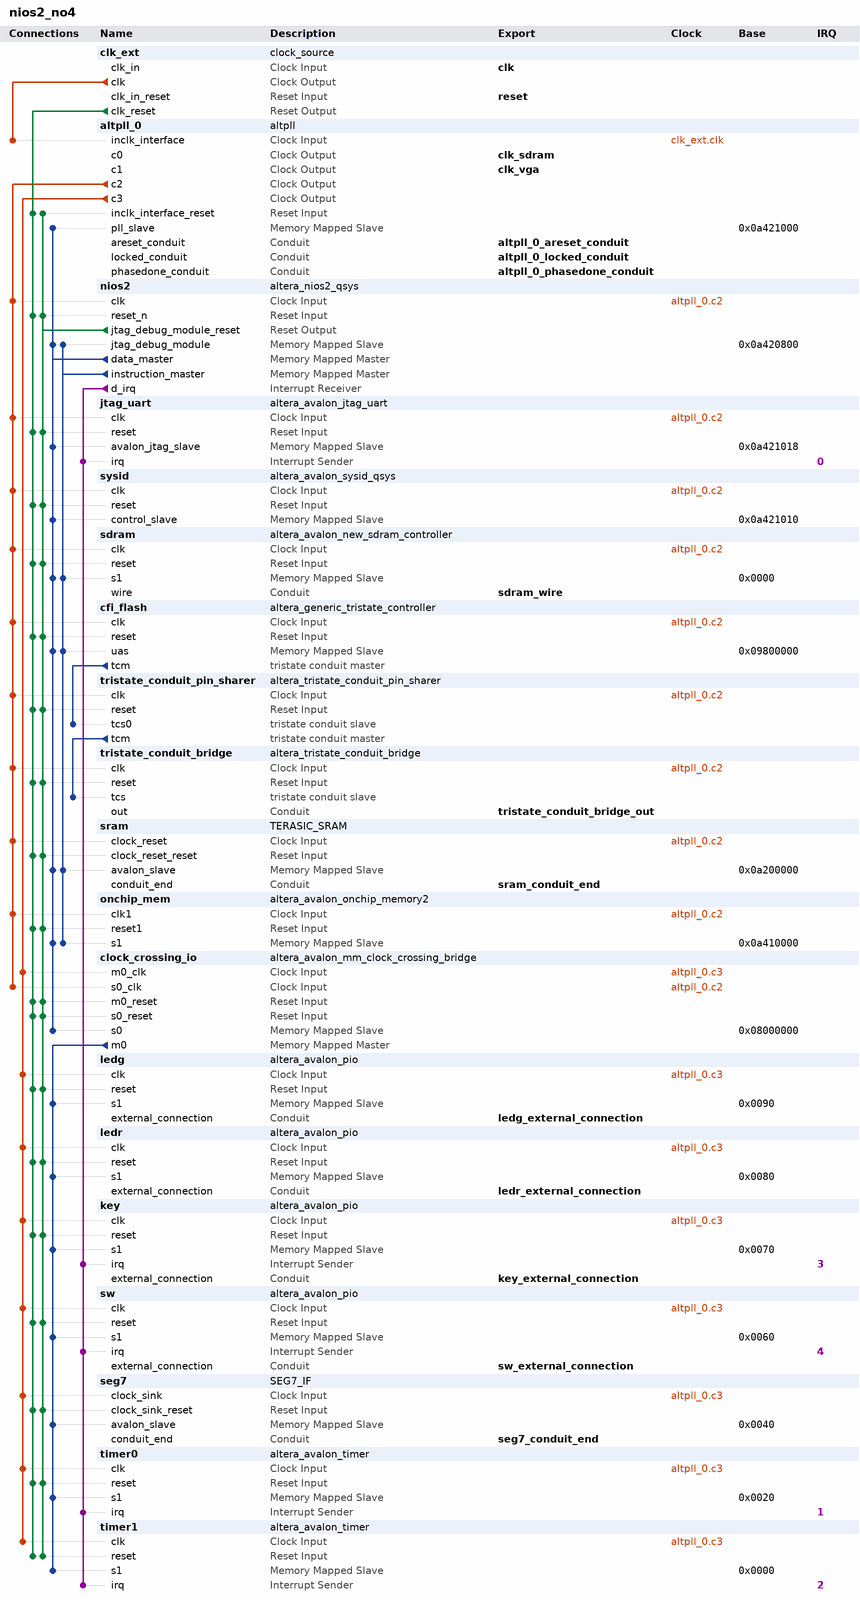
[diagram p0: system contents]
# Platform Designer (Qsys) system nios2_no4, Cyclone IV E EP4CE115F29C7
# Parameters at their usual value, and those the tool derives, are not listed.
package require -exact qsys 13.1
create_system nios2_no4
set_project_property DEVICE_FAMILY {Cyclone IV E}
set_project_property DEVICE EP4CE115F29C7

add_instance clk_ext clock_source 13.1
set_instance_parameter_value clk_ext clockFrequency 50000000

add_instance altpll_0 altpll 13.1
set_instance_parameter_value altpll_0 INCLK0_INPUT_FREQUENCY 20000
set_instance_parameter_value altpll_0 CLK0_MULTIPLY_BY 2
set_instance_parameter_value altpll_0 CLK1_MULTIPLY_BY 1
set_instance_parameter_value altpll_0 CLK2_MULTIPLY_BY 2
set_instance_parameter_value altpll_0 CLK3_MULTIPLY_BY 1
set_instance_parameter_value altpll_0 CLK0_DIVIDE_BY 1
set_instance_parameter_value altpll_0 CLK1_DIVIDE_BY 2
set_instance_parameter_value altpll_0 CLK2_DIVIDE_BY 1
set_instance_parameter_value altpll_0 CLK3_DIVIDE_BY 1
set_instance_parameter_value altpll_0 CLK0_PHASE_SHIFT -1806
set_instance_parameter_value altpll_0 CLK1_PHASE_SHIFT 0
set_instance_parameter_value altpll_0 CLK2_PHASE_SHIFT 0
set_instance_parameter_value altpll_0 CLK3_PHASE_SHIFT 0
set_instance_parameter_value altpll_0 CLK1_DUTY_CYCLE 50
set_instance_parameter_value altpll_0 CLK2_DUTY_CYCLE 50
set_instance_parameter_value altpll_0 CLK3_DUTY_CYCLE 50
set_instance_parameter_value altpll_0 PORT_clk1 PORT_USED
set_instance_parameter_value altpll_0 PORT_clk2 PORT_USED
set_instance_parameter_value altpll_0 PORT_clk3 PORT_USED
set_instance_parameter_value altpll_0 PORT_ARESET PORT_USED
set_instance_parameter_value altpll_0 PORT_LOCKED PORT_USED

add_instance nios2 altera_nios2_qsys 13.1
set_instance_parameter_value nios2 resetSlave cfi_flash.uas
set_instance_parameter_value nios2 mmu_TLBMissExcSlave None
set_instance_parameter_value nios2 exceptionSlave sdram.s1
set_instance_parameter_value nios2 breakSlave nios2.jtag_debug_module
set_instance_parameter_value nios2 impl Fast
set_instance_parameter_value nios2 icache_size 4096

add_instance jtag_uart altera_avalon_jtag_uart 13.1
set_instance_parameter_value jtag_uart simInteractiveOptions NO_INTERACTIVE_WINDOWS

add_instance sysid altera_avalon_sysid_qsys 13.1
set_instance_parameter_value sysid id 0

add_instance sdram altera_avalon_new_sdram_controller 13.1
set_instance_parameter_value sdram TAC 5.5
set_instance_parameter_value sdram TRCD 20.0
set_instance_parameter_value sdram TRP 20.0
set_instance_parameter_value sdram casLatency 3
set_instance_parameter_value sdram columnWidth 10
set_instance_parameter_value sdram dataWidth 32
set_instance_parameter_value sdram generateSimulationModel false
set_instance_parameter_value sdram model single_Micron_MT48LC4M32B2_7_chip
set_instance_parameter_value sdram numberOfBanks 4
set_instance_parameter_value sdram numberOfChipSelects 1
set_instance_parameter_value sdram powerUpDelay 100.0
set_instance_parameter_value sdram refreshPeriod 15.625
set_instance_parameter_value sdram rowWidth 13

add_instance cfi_flash altera_generic_tristate_controller 13.1
set_instance_parameter_value cfi_flash TCM_ADDRESS_W 23
set_instance_parameter_value cfi_flash TCM_DATA_W 8
set_instance_parameter_value cfi_flash TCM_BYTEENABLE_W 1
set_instance_parameter_value cfi_flash TCM_READ_WAIT 160
set_instance_parameter_value cfi_flash TCM_WRITE_WAIT 160
set_instance_parameter_value cfi_flash TCM_SETUP_WAIT 60
set_instance_parameter_value cfi_flash TCM_DATA_HOLD 60
set_instance_parameter_value cfi_flash TCM_MAX_PENDING_READ_TRANSACTIONS 3
set_instance_parameter_value cfi_flash TCM_TURNAROUND_TIME 2
set_instance_parameter_value cfi_flash TCM_TIMING_UNITS 0
set_instance_parameter_value cfi_flash TCM_READLATENCY 2
set_instance_parameter_value cfi_flash TCM_SYMBOLS_PER_WORD 1
set_instance_parameter_value cfi_flash USE_READ 1
set_instance_parameter_value cfi_flash USE_BEGINTRANSFER 0
set_instance_parameter_value cfi_flash USE_BYTEENABLE 0
set_instance_parameter_value cfi_flash USE_OUTPUTENABLE 0
set_instance_parameter_value cfi_flash ACTIVE_LOW_READ 1
set_instance_parameter_value cfi_flash ACTIVE_LOW_BYTEENABLE 0
set_instance_parameter_value cfi_flash ACTIVE_LOW_OUTPUTENABLE 0
set_instance_parameter_value cfi_flash ACTIVE_LOW_BEGINTRANSFER 0
set_instance_parameter_value cfi_flash CHIPSELECT_THROUGH_READLATENCY 0
set_instance_parameter_value cfi_flash MODULE_ASSIGNMENT_KEYS embeddedsw.configuration.hwClassnameDriverSupportList,embeddedsw.configuration.hwClassnameDriverSupportDefault,embeddedsw.CMacro.SETUP_VALUE,embeddedsw.CMacro.WAIT_VALUE,embeddedsw.CMacro.HOLD_VALUE,embeddedsw.CMacro.TIMING_UNITS,embeddedsw.CMacro.SIZE,embeddedsw.memoryInfo.MEM_INIT_DATA_WIDTH,embeddedsw.memoryInfo.HAS_BYTE_LANE,embeddedsw.memoryInfo.IS_FLASH,embeddedsw.memoryInfo.GENERATE_DAT_SYM,embeddedsw.memoryInfo.GENERATE_FLASH,embeddedsw.memoryInfo.DAT_SYM_INSTALL_DIR,embeddedsw.memoryInfo.FLASH_INSTALL_DIR
set_instance_parameter_value cfi_flash MODULE_ASSIGNMENT_VALUES altera_avalon_lan91c111:altera_avalon_cfi_flash,altera_avalon_cfi_flash,60,160,60,ns,8388608u,8,0,1,1,1,SIM_DIR,APP_DIR
set_instance_parameter_value cfi_flash INTERFACE_ASSIGNMENT_KEYS embeddedsw.configuration.isFlash,embeddedsw.configuration.isMemoryDevice,embeddedsw.configuration.isNonVolatileStorage
set_instance_parameter_value cfi_flash INTERFACE_ASSIGNMENT_VALUES 1,1,1

add_instance tristate_conduit_pin_sharer altera_tristate_conduit_pin_sharer 13.1
set_instance_parameter_value tristate_conduit_pin_sharer NUM_INTERFACES 1
set_instance_parameter_value tristate_conduit_pin_sharer MODULE_ORIGIN_LIST cfi_flash.tcm,cfi_flash.tcm,cfi_flash.tcm,cfi_flash.tcm,cfi_flash.tcm
set_instance_parameter_value tristate_conduit_pin_sharer SHARED_SIGNAL_LIST FL_ADDR,FL_OE_N,FL_WE_N,FL_DQ,FL_CE_N

add_instance tristate_conduit_bridge altera_tristate_conduit_bridge 13.1

add_instance sram TERASIC_SRAM 1.0
set_instance_parameter_value sram DATA_BITS 16
set_instance_parameter_value sram ADDR_BITS 20

add_instance onchip_mem altera_avalon_onchip_memory2 13.1
set_instance_parameter_value onchip_mem dataWidth 32
set_instance_parameter_value onchip_mem dualPort false
set_instance_parameter_value onchip_mem initMemContent true
set_instance_parameter_value onchip_mem initializationFileName onchip_mem.hex
set_instance_parameter_value onchip_mem memorySize 65536

add_instance clock_crossing_io altera_avalon_mm_clock_crossing_bridge 13.1
set_instance_parameter_value clock_crossing_io DATA_WIDTH 32
set_instance_parameter_value clock_crossing_io ADDRESS_WIDTH 10
set_instance_parameter_value clock_crossing_io MAX_BURST_SIZE 1
set_instance_parameter_value clock_crossing_io COMMAND_FIFO_DEPTH 32
set_instance_parameter_value clock_crossing_io RESPONSE_FIFO_DEPTH 256
set_instance_parameter_value clock_crossing_io MASTER_SYNC_DEPTH 3
set_instance_parameter_value clock_crossing_io SLAVE_SYNC_DEPTH 3

add_instance ledg altera_avalon_pio 13.1
set_instance_parameter_value ledg direction Output
set_instance_parameter_value ledg width 9

add_instance ledr altera_avalon_pio 13.1
set_instance_parameter_value ledr direction Output
set_instance_parameter_value ledr width 18

add_instance key altera_avalon_pio 13.1
set_instance_parameter_value key captureEdge true
set_instance_parameter_value key direction Input
set_instance_parameter_value key edgeType FALLING
set_instance_parameter_value key generateIRQ true
set_instance_parameter_value key irqType EDGE
set_instance_parameter_value key simDoTestBenchWiring true
set_instance_parameter_value key width 4

add_instance sw altera_avalon_pio 13.1
set_instance_parameter_value sw captureEdge true
set_instance_parameter_value sw direction Input
set_instance_parameter_value sw edgeType ANY
set_instance_parameter_value sw generateIRQ true
set_instance_parameter_value sw irqType EDGE
set_instance_parameter_value sw simDoTestBenchWiring true
set_instance_parameter_value sw width 18

add_instance seg7 SEG7_IF 1.0
set_instance_parameter_value seg7 SEG7_NUM 8

add_instance timer0 altera_avalon_timer 13.1
set_instance_parameter_value timer0 period 1
set_instance_parameter_value timer0 periodUnits MSEC

add_instance timer1 altera_avalon_timer 13.1
set_instance_parameter_value timer1 period 1
set_instance_parameter_value timer1 periodUnits MSEC

# connections
add_connection altpll_0.c2 cfi_flash.clk clock
add_connection altpll_0.c2 clock_crossing_io.s0_clk clock
add_connection altpll_0.c2 jtag_uart.clk clock
add_connection altpll_0.c2 nios2.clk clock
add_connection altpll_0.c2 onchip_mem.clk1 clock
add_connection altpll_0.c2 sdram.clk clock
add_connection altpll_0.c2 sram.clock_reset clock
add_connection altpll_0.c2 sysid.clk clock
add_connection altpll_0.c2 tristate_conduit_bridge.clk clock
add_connection altpll_0.c2 tristate_conduit_pin_sharer.clk clock
add_connection altpll_0.c3 clock_crossing_io.m0_clk clock
add_connection altpll_0.c3 key.clk clock
add_connection altpll_0.c3 ledg.clk clock
add_connection altpll_0.c3 ledr.clk clock
add_connection altpll_0.c3 seg7.clock_sink clock
add_connection altpll_0.c3 sw.clk clock
add_connection altpll_0.c3 timer0.clk clock
add_connection altpll_0.c3 timer1.clk clock
add_connection clk_ext.clk altpll_0.inclk_interface clock
add_connection clk_ext.clk_reset altpll_0.inclk_interface_reset reset
add_connection clk_ext.clk_reset cfi_flash.reset reset
add_connection clk_ext.clk_reset clock_crossing_io.m0_reset reset
add_connection clk_ext.clk_reset clock_crossing_io.s0_reset reset
add_connection clk_ext.clk_reset jtag_uart.reset reset
add_connection clk_ext.clk_reset key.reset reset
add_connection clk_ext.clk_reset ledg.reset reset
add_connection clk_ext.clk_reset ledr.reset reset
add_connection clk_ext.clk_reset nios2.reset_n reset
add_connection clk_ext.clk_reset onchip_mem.reset1 reset
add_connection clk_ext.clk_reset sdram.reset reset
add_connection clk_ext.clk_reset seg7.clock_sink_reset reset
add_connection clk_ext.clk_reset sram.clock_reset_reset reset
add_connection clk_ext.clk_reset sw.reset reset
add_connection clk_ext.clk_reset sysid.reset reset
add_connection clk_ext.clk_reset timer0.reset reset
add_connection clk_ext.clk_reset timer1.reset reset
add_connection clk_ext.clk_reset tristate_conduit_bridge.reset reset
add_connection clk_ext.clk_reset tristate_conduit_pin_sharer.reset reset
add_connection nios2.jtag_debug_module_reset altpll_0.inclk_interface_reset reset
add_connection nios2.jtag_debug_module_reset cfi_flash.reset reset
add_connection nios2.jtag_debug_module_reset clock_crossing_io.m0_reset reset
add_connection nios2.jtag_debug_module_reset clock_crossing_io.s0_reset reset
add_connection nios2.jtag_debug_module_reset jtag_uart.reset reset
add_connection nios2.jtag_debug_module_reset key.reset reset
add_connection nios2.jtag_debug_module_reset ledg.reset reset
add_connection nios2.jtag_debug_module_reset ledr.reset reset
add_connection nios2.jtag_debug_module_reset nios2.reset_n reset
add_connection nios2.jtag_debug_module_reset onchip_mem.reset1 reset
add_connection nios2.jtag_debug_module_reset sdram.reset reset
add_connection nios2.jtag_debug_module_reset seg7.clock_sink_reset reset
add_connection nios2.jtag_debug_module_reset sram.clock_reset_reset reset
add_connection nios2.jtag_debug_module_reset sw.reset reset
add_connection nios2.jtag_debug_module_reset sysid.reset reset
add_connection nios2.jtag_debug_module_reset timer0.reset reset
add_connection nios2.jtag_debug_module_reset timer1.reset reset
add_connection nios2.jtag_debug_module_reset tristate_conduit_bridge.reset reset
add_connection nios2.jtag_debug_module_reset tristate_conduit_pin_sharer.reset reset
add_connection clock_crossing_io.m0 key.s1 avalon
set_connection_parameter_value clock_crossing_io.m0/key.s1 baseAddress 0x0070
add_connection clock_crossing_io.m0 ledg.s1 avalon
set_connection_parameter_value clock_crossing_io.m0/ledg.s1 baseAddress 0x0090
add_connection clock_crossing_io.m0 ledr.s1 avalon
set_connection_parameter_value clock_crossing_io.m0/ledr.s1 baseAddress 0x0080
add_connection clock_crossing_io.m0 seg7.avalon_slave avalon
set_connection_parameter_value clock_crossing_io.m0/seg7.avalon_slave baseAddress 0x0040
add_connection clock_crossing_io.m0 sw.s1 avalon
set_connection_parameter_value clock_crossing_io.m0/sw.s1 baseAddress 0x0060
add_connection clock_crossing_io.m0 timer0.s1 avalon
set_connection_parameter_value clock_crossing_io.m0/timer0.s1 baseAddress 0x0020
add_connection clock_crossing_io.m0 timer1.s1 avalon
set_connection_parameter_value clock_crossing_io.m0/timer1.s1 baseAddress 0x0000
add_connection nios2.data_master altpll_0.pll_slave avalon
set_connection_parameter_value nios2.data_master/altpll_0.pll_slave baseAddress 0x0a421000
add_connection nios2.data_master cfi_flash.uas avalon
set_connection_parameter_value nios2.data_master/cfi_flash.uas baseAddress 0x09800000
add_connection nios2.data_master clock_crossing_io.s0 avalon
set_connection_parameter_value nios2.data_master/clock_crossing_io.s0 baseAddress 0x08000000
add_connection nios2.data_master jtag_uart.avalon_jtag_slave avalon
set_connection_parameter_value nios2.data_master/jtag_uart.avalon_jtag_slave baseAddress 0x0a421018
add_connection nios2.data_master nios2.jtag_debug_module avalon
set_connection_parameter_value nios2.data_master/nios2.jtag_debug_module baseAddress 0x0a420800
add_connection nios2.data_master onchip_mem.s1 avalon
set_connection_parameter_value nios2.data_master/onchip_mem.s1 baseAddress 0x0a410000
add_connection nios2.data_master sdram.s1 avalon
set_connection_parameter_value nios2.data_master/sdram.s1 baseAddress 0x0000
add_connection nios2.data_master sram.avalon_slave avalon
set_connection_parameter_value nios2.data_master/sram.avalon_slave baseAddress 0x0a200000
add_connection nios2.data_master sysid.control_slave avalon
set_connection_parameter_value nios2.data_master/sysid.control_slave baseAddress 0x0a421010
add_connection nios2.instruction_master cfi_flash.uas avalon
set_connection_parameter_value nios2.instruction_master/cfi_flash.uas baseAddress 0x09800000
add_connection nios2.instruction_master nios2.jtag_debug_module avalon
set_connection_parameter_value nios2.instruction_master/nios2.jtag_debug_module baseAddress 0x0a420800
add_connection nios2.instruction_master onchip_mem.s1 avalon
set_connection_parameter_value nios2.instruction_master/onchip_mem.s1 baseAddress 0x0a410000
add_connection nios2.instruction_master sdram.s1 avalon
set_connection_parameter_value nios2.instruction_master/sdram.s1 baseAddress 0x0000
add_connection nios2.instruction_master sram.avalon_slave avalon
set_connection_parameter_value nios2.instruction_master/sram.avalon_slave baseAddress 0x0a200000
add_connection nios2.d_irq jtag_uart.irq interrupt
set_connection_parameter_value nios2.d_irq/jtag_uart.irq irqNumber 0
add_connection nios2.d_irq key.irq interrupt
set_connection_parameter_value nios2.d_irq/key.irq irqNumber 3
add_connection nios2.d_irq sw.irq interrupt
set_connection_parameter_value nios2.d_irq/sw.irq irqNumber 4
add_connection nios2.d_irq timer0.irq interrupt
set_connection_parameter_value nios2.d_irq/timer0.irq irqNumber 1
add_connection nios2.d_irq timer1.irq interrupt
set_connection_parameter_value nios2.d_irq/timer1.irq irqNumber 2
add_connection cfi_flash.tcm tristate_conduit_pin_sharer.tcs0 tristate_conduit
add_connection tristate_conduit_pin_sharer.tcm tristate_conduit_bridge.tcs tristate_conduit

# exported interfaces
add_interface clk clock sink
set_interface_property clk EXPORT_OF clk_ext.clk_in
add_interface reset reset sink
set_interface_property reset EXPORT_OF clk_ext.clk_in_reset
add_interface clk_sdram clock source
set_interface_property clk_sdram EXPORT_OF altpll_0.c0
add_interface clk_vga clock source
set_interface_property clk_vga EXPORT_OF altpll_0.c1
add_interface altpll_0_areset_conduit conduit end
set_interface_property altpll_0_areset_conduit EXPORT_OF altpll_0.areset_conduit
add_interface altpll_0_locked_conduit conduit end
set_interface_property altpll_0_locked_conduit EXPORT_OF altpll_0.locked_conduit
add_interface altpll_0_phasedone_conduit conduit end
set_interface_property altpll_0_phasedone_conduit EXPORT_OF altpll_0.phasedone_conduit
add_interface sdram_wire conduit end
set_interface_property sdram_wire EXPORT_OF sdram.wire
add_interface tristate_conduit_bridge_out conduit end
set_interface_property tristate_conduit_bridge_out EXPORT_OF tristate_conduit_bridge.out
add_interface sram_conduit_end conduit end
set_interface_property sram_conduit_end EXPORT_OF sram.conduit_end
add_interface ledg_external_connection conduit end
set_interface_property ledg_external_connection EXPORT_OF ledg.external_connection
add_interface ledr_external_connection conduit end
set_interface_property ledr_external_connection EXPORT_OF ledr.external_connection
add_interface key_external_connection conduit end
set_interface_property key_external_connection EXPORT_OF key.external_connection
add_interface sw_external_connection conduit end
set_interface_property sw_external_connection EXPORT_OF sw.external_connection
add_interface seg7_conduit_end conduit end
set_interface_property seg7_conduit_end EXPORT_OF seg7.conduit_end

set_interconnect_requirement {$system} qsys_mm.clockCrossingAdapter HANDSHAKE
set_interconnect_requirement {$system} qsys_mm.maxAdditionalLatency 1
set_interconnect_requirement {$system} qsys_mm.insertDefaultSlave false

save_system nios2_no4.qsys
